# EAGLE schematic motherboard (EAGLE 8.5.0)
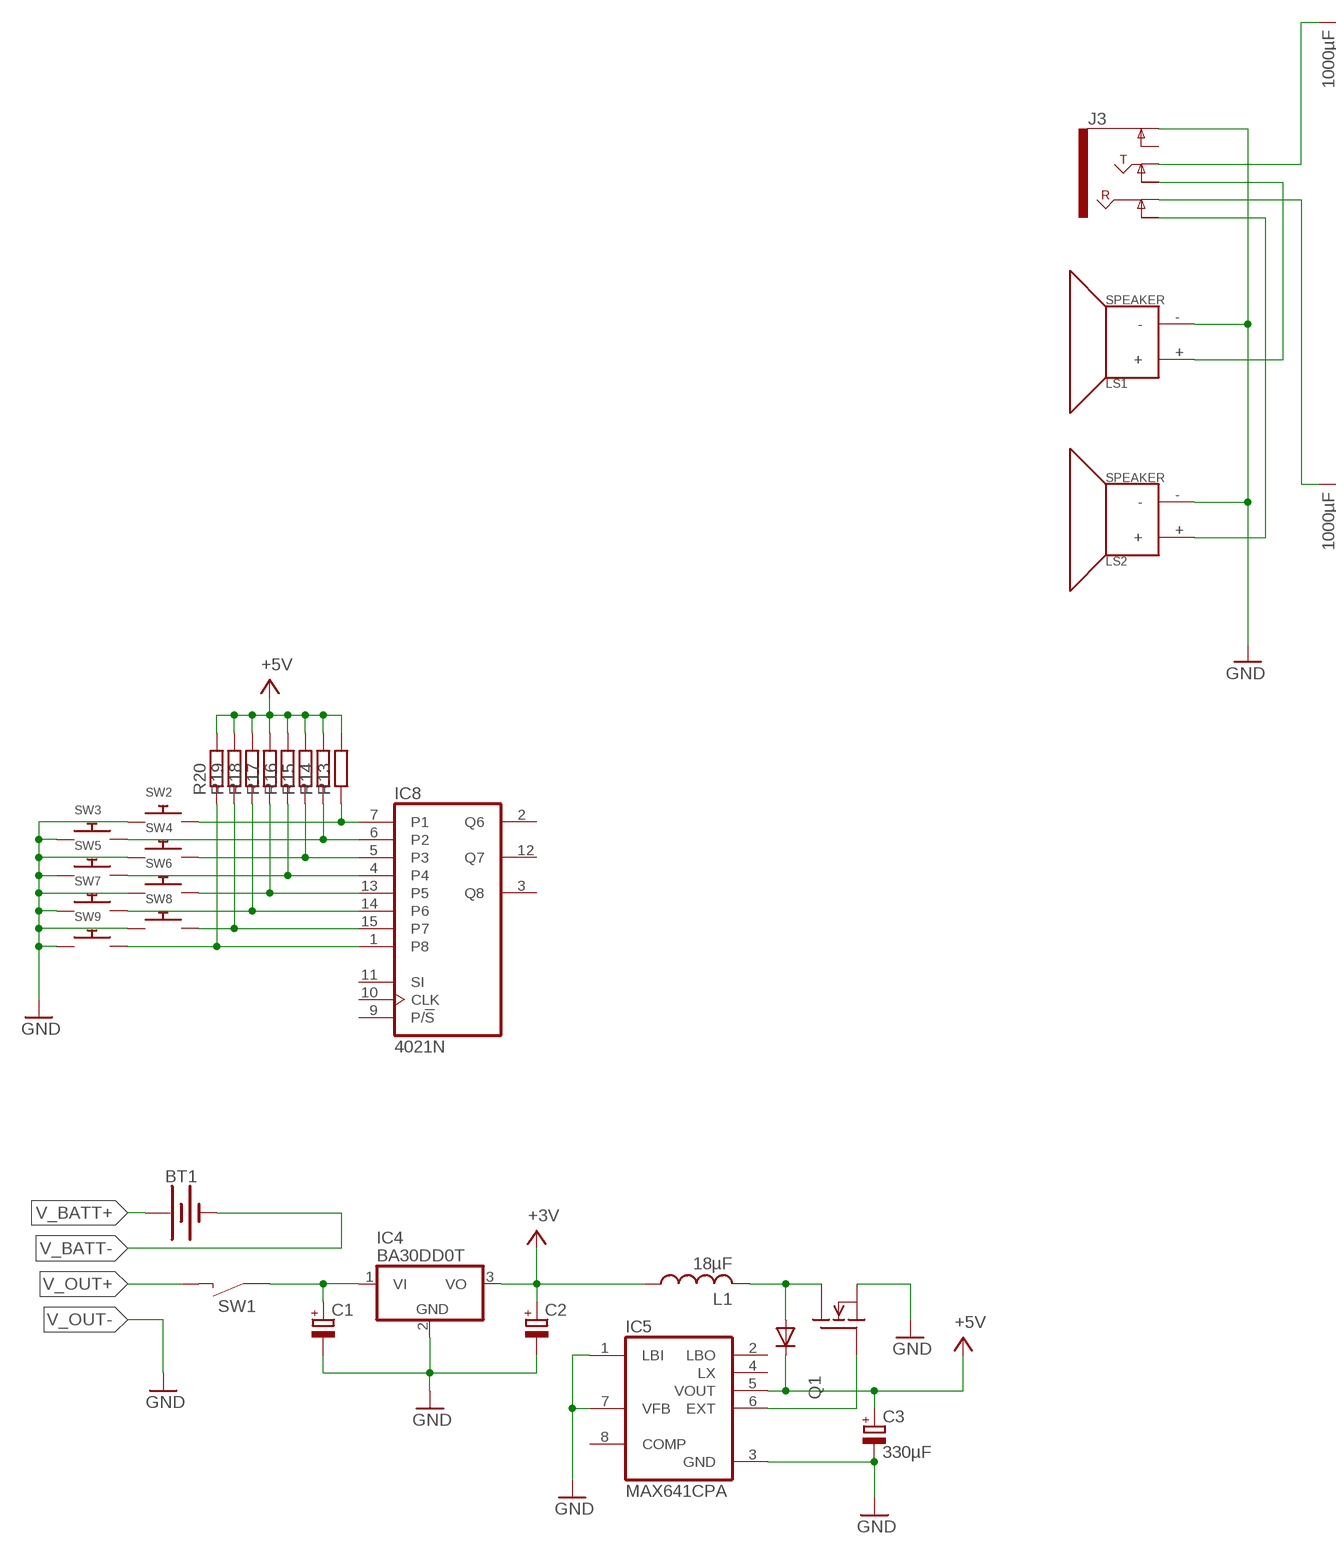
[diagram p0: schematic, sheet 1, part 1 of 2]
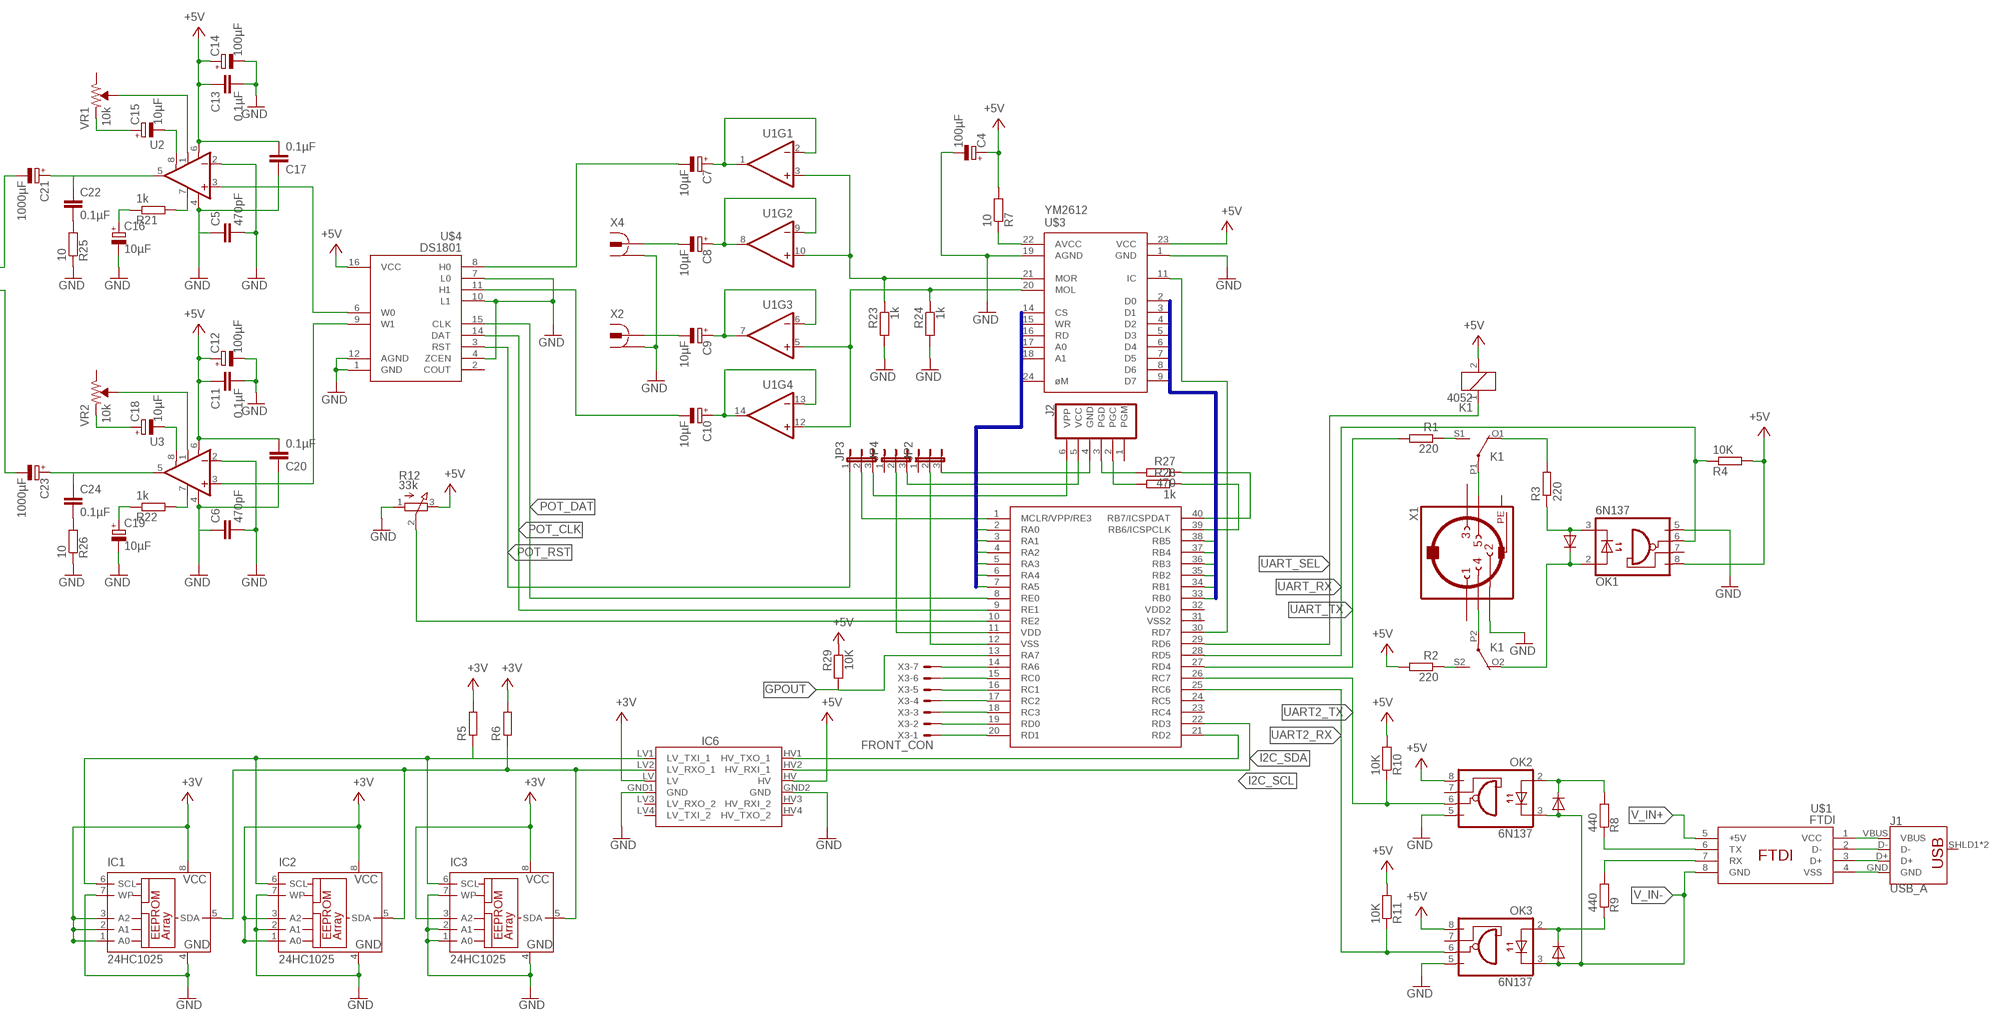
[diagram p1: schematic, sheet 1, part 2 of 2]

## Parts
BT1  BATTERY-9V  [BATTCON_9V]
C1  CPOL-EUE2,5-6E  [E2,5-6E]
C2  CPOL-EUE1.8-4  [E1,8-4]
C3  330µF  CPOL-EUE1.8-4  [E1,8-4]
C4  100µF  CPOL-EU140CLH-1010  [140CLH-1010]
C5  470pF  CAPACITOR_0805_M  [RESC0805_M]
C6  470pF  CAPACITOR_0805_M  [RESC0805_M]
C7  10µF  CPOL-EU140CLH-1010  [140CLH-1010]
C8  10µF  CPOL-EU140CLH-1010  [140CLH-1010]
C9  10µF  CPOL-EU140CLH-1010  [140CLH-1010]
C10  10µF  CPOL-EU140CLH-1010  [140CLH-1010]
C11  0.1µF  CAPACITOR_0805_M  [RESC0805_M]
C12  100µF  CPOL-EU140CLH-1010  [140CLH-1010]
C13  0.1µF  CAPACITOR_0805_M  [RESC0805_M]
C14  100µF  CPOL-EU140CLH-1010  [140CLH-1010]
C15  10µF  CPOL-EU140CLH-1010  [140CLH-1010]
C16  10µF  CPOL-EU140CLH-1010  [140CLH-1010]
C17  0.1µF  CAPACITOR_0805_M  [RESC0805_M]
C18  10µF  CPOL-EU140CLH-1010  [140CLH-1010]
C19  10µF  CPOL-EU140CLH-1010  [140CLH-1010]
C20  0.1µF  CAPACITOR_0805_M  [RESC0805_M]
C21  1000µF  CPOL-EU140CLH-1010  [140CLH-1010]
C22  0.1µF  CAPACITOR_0805_M  [RESC0805_M]
C23  1000µF  CPOL-EU140CLH-1010  [140CLH-1010]
C24  0.1µF  CAPACITOR_0805_M  [RESC0805_M]
IC1  24HC1025  24LC256P  [DIL8]
IC2  24HC1025  24LC256P  [DIL8]
IC3  24HC1025  24LC256P  [DIL8]
IC4  BA30DD0T  LM340H-18  [TO220H]
IC5  MAX641CPA  [DIL08]
IC6  SPARKFUN_LOGIC_LEVEL_CONVERTER  [SPARKFUN_LOGIC_LEVEL_CONVERTER]
IC8  4021N  [DIL16]
J1  USB_A  USB_A_PTH_MALE  [USB-A-H]
J2  PIC_ICSP_6_PIN  [MOLEX-1X6]
J3  AUDIO_JACK_TRS_0.25"_PTH_RA  [AUDIO_JACK_0.25"_TRS_PTH_RA]
JP2  JP2E  [JP2]
JP3  JP2E  [JP2]
JP4  JP2E  [JP2]
K1  4052  [F4052]
L1  18µF  L-USTJ3-U2  [TJ3-U2]
LS1  SPEAKER  [PCB_MOUNT_SPEAKER]
LS2  SPEAKER  [PCB_MOUNT_SPEAKER]
OK1  6N137  [DIL08]
OK2  6N137  [DIL08]
OK3  6N137  [DIL08]
Q1  BUZ230  [TO3]
R1  220  R-EU_0204/7  [0204/7]
R2  220  R-EU_0204/7  [0204/7]
R3  220  R-EU_0204/7  [0204/7]
R4  10K  R-EU_0204/7  [0204/7]
R5  R-EU_0204/7  [0204/7]
R6  R-EU_0204/7  [0204/7]
R7  10  R-EU_0207/10  [0207/10]
R8  440  R-EU_0204/7  [0204/7]
R9  440  R-EU_0204/7  [0204/7]
R10  10K  R-EU_0204/7  [0204/7]
R11  10K  R-EU_0204/7  [0204/7]
R12  33k  3RP/1610N  [3RP/1610N]
R13  R-EU_0204/7  [0204/7]
R14  R-EU_0204/7  [0204/7]
R15  R-EU_0204/7  [0204/7]
R16  R-EU_0204/7  [0204/7]
R17  R-EU_0204/7  [0204/7]
R18  R-EU_0204/7  [0204/7]
R19  R-EU_0204/7  [0204/7]
R20  R-EU_0204/7  [0204/7]
R21  1k  R-EU_0207/10  [0207/10]
R22  1k  R-EU_0207/10  [0207/10]
R23  1k  R-EU_0207/10  [0207/10]
R24  1k  R-EU_0207/10  [0207/10]
R25  10  R-EU_0207/10  [0207/10]
R26  10  R-EU_0207/10  [0207/10]
R27  470  R-EU_0207/10  [0207/10]
R28  1k  R-EU_0207/10  [0207/10]
R29  10K  R-EU_0207/10  [0207/10]
SW1  46202LRX  [46202LRX]
SW2  SWITCH_PUSHBUTTONEVQ-PE  [TACT_PANA-EVQ]
SW3  SWITCH_PUSHBUTTONEVQ-PE  [TACT_PANA-EVQ]
SW4  SWITCH_PUSHBUTTONEVQ-PE  [TACT_PANA-EVQ]
SW5  SWITCH_PUSHBUTTONEVQ-PE  [TACT_PANA-EVQ]
SW6  SWITCH_PUSHBUTTONEVQ-PE  [TACT_PANA-EVQ]
SW7  SWITCH_PUSHBUTTONEVQ-PE  [TACT_PANA-EVQ]
SW8  SWITCH_PUSHBUTTONEVQ-PE  [TACT_PANA-EVQ]
SW9  SWITCH_PUSHBUTTONEVQ-PE  [TACT_PANA-EVQ]
U1  LMV324  [SO14]
U2  LM386  [DIP08]
U3  LM386  [DIP08]
U$1  FTDI  [FTDI]
U$2  PIC18F47K40  [PIC18F47K40]
U$3  YM2612  [YM2612]
U$4  DS1801  [DS1081]
VR1  10k  TRIMPOT-PTH-10MM-KNOB-1/2W-10%  [TRIMPOT-PTH-3386U]
VR2  10k  TRIMPOT-PTH-10MM-KNOB-1/2W-10%  [TRIMPOT-PTH-3386U]
X1  MAB5SH  [MAB5SH]
X2  736880-49  [736880-49]
X3  FRONT_CON  22-23-2071  [22-23-2071]
X4  736880-49  [736880-49]

## Nets
GND: C1.- C2.- C3.- C4.- C5.1 C5.2 C6.1 C6.2 C11.2 C12.- C13.2 C14.- C16.- C17.1 C19.- C20.1 IC4.2(GND) IC5.1(LBI) IC5.3(GND) IC5.7(VFB) IC6.GND1(GND) IC6.GND2(GND) J3.SLEEVE(EARTH) LS1.- LS2.- OK1.5(GND) OK2.5(GND) OK3.5(GND) Q1.1(S) R12.1(A) R23.2 R24.2 R25.1 R26.1 SW2.P$1 SW3.P$1 SW4.P$1 SW5.P$1 SW6.P$1 SW7.P$1 SW8.P$1 SW9.P$1 U2.2(-IN) U2.4(V-) U3.2(-IN) U3.4(V-) U$3.1(GND) U$3.19(AGND) U$4.1(GND) U$4.4(ZCEN) U$4.7(L0) U$4.10(L1) U$4.12(AGND) X1.2 X2.1 X2.1@1 X2.1@2 X4.1 X4.1@1 X4.1@2
GPOUT: R29.2 U$2.13(RA7)
I2C_SCL: IC6.HV1(HV_TXO_1) U$2.21(RD2)
I2C_SCL_3V: IC1.6(SCL) IC2.6(SCL) IC3.6(SCL) IC6.LV1(LV_TXI_1) R5.1
I2C_SDA: IC6.HV2(HV_RXI_1) U$2.22(RD3)
I2C_SDA_3V: IC1.5(SDA) IC2.5(SDA) IC3.5(SDA) IC6.LV2(LV_RXO_1) R6.1
N$1: K1.P2(3:P) X1.4
N$2: K1.P1(2:P) X1.5
N$3: K1.S1(2:S) R1.1
N$4: K1.S2(3:S) R2.1
N$5: K1.O1(2:O) R3.2
N$6: OK1.3(C) R3.1
N$7: K1.O2(3:O) OK1.2(A)
N$8: L1.2 Q1.3(D) Q1.4(D)
N$9: C7.+ U1.1(OUT) U1.2(-IN)
N$10: IC5.6(EXT) Q1.2(G)
N$11: J1.VBUS U$1.1(VCC)
N$12: J1.D- U$1.2(D-)
N$13: J1.D+ U$1.3(D+)
N$14: J1.GND U$1.4(VSS)
N$15: OK2.2(A) R8.2
N$16: R9.2 U$1.7(RX)
N$17: R8.1 U$1.6(TX)
N$18: OK3.2(A) R9.1
N$19: J3.RING-NORM LS2.+
N$20: J3.TIP-NORM LS1.+
N$21: U$2.30(RD7) U$3.11(IC)
N$22: R27.1 U$2.40(RB7/ICSPDAT)
N$23: U$2.3(RA1)
N$24: U$2.4(RA2)
N$25: U$2.5(RA3)
N$26: U$2.6(RA4)
N$27: U$2.7(RA5)
N$28: U$2.2(RA0)
N$29: R28.1 U$2.39(RB6/ICSPCLK)
N$30: U$2.38(RB5)
N$31: U$2.37(RB4)
N$32: U$2.36(RB3)
N$33: U$2.35(RB2)
N$34: U$2.34(RB1)
N$35: U$2.33(RB0)
N$36: R12.2(S) U$2.10(RE2)
N$37: U$2.14(RA6) X3.7
N$38: U$2.15(RC0) X3.6
N$39: U$2.16(RC1) X3.5
N$40: U$2.17(RC2) X3.4
N$41: U$2.18(RC3) X3.3
N$42: U$2.19(RD0) X3.2
N$43: U$2.20(RD1) X3.1
N$44: SW1.P$2(B)
N$45: IC8.7(P1) R13.1 SW2.P$2
N$46: IC8.5(P3) R15.1 SW4.P$2
N$47: IC8.6(P2) R14.1 SW3.P$2
N$48: IC8.4 R16.1 SW5.P$2
N$49: IC8.13(P5) R17.1 SW6.P$2
N$50: IC8.14(P6) R18.1 SW7.P$2
N$51: IC8.15(P7) R19.1 SW8.P$2
N$52: IC8.1(P8) R20.1 SW9.P$2
N$53: JP4.2 U$2.11(VDD)
N$54: C15.+ VR1.1(CCW)
N$55: U2.1(GAIN) VR1.2(WIPER)
N$56: C21.+ C22.1 U2.5(OUT)
N$57: C23.+ C24.1 U3.5(OUT)
N$58: R23.1 U1.3(+IN) U1.10(+IN) U$3.21(MOR)
N$59: R24.1 U1.5(+IN) U1.12(+IN) U$3.20(MOL)
N$60: C15.- U2.8(GAIN)
N$61: R7.1 U$3.22(AVCC)
N$62: C8.+ U1.8(OUT) U1.9(-IN)
N$63: C9.+ U1.6(-IN) U1.7(OUT)
N$64: C10.+ U1.13(-IN) U1.14(OUT)
N$65: C8.- X4.2
N$66: C9.- X2.2
N$67: C7.- U$4.8(H0)
N$68: C10.- U$4.11(H1)
N$69: U2.3(+IN) U$4.6(W0)
N$70: C22.2 R25.2
N$71: R21.2 U2.7(BP)
N$72: C16.+ R21.1
N$73: U3.3(+IN) U$4.9(W1)
N$74: U3.1(GAIN) VR2.2(WIPER)
N$75: C18.+ VR2.1(CCW)
N$76: C18.- U3.8(GAIN)
N$77: R22.2 U3.7(BP)
N$78: C19.+ R22.1
N$79: C24.2 R26.2
N$80: C21.- J3.TIP
N$81: C23.- J3.RING
N$82: JP2.2 U$2.12(VSS)
N$83: J2.4(GND) JP2.3
N$84: J2.5(VCC) JP4.3
N$85: JP3.2 U$2.1(MCLR/VPP/RE3)
N$86: J2.6(VPP) JP3.3
N$87: J2.3(PGD) R27.2
N$88: J2.2(PGC) R28.2
POT_CLK: U$2.8(RE0) U$4.15(CLK)
POT_DAT: U$2.9(RE1) U$4.14(DAT)
POT_RST: JP3.1 U$4.3(RST)
UART2_RX: OK3.6(VO) R11.1 U$2.25(RC6)
UART2_TX: OK2.6(VO) R10.1 U$2.26(RC7)
UART_RX: OK1.6(VO) R4.1 U$2.28(RD5)
UART_SEL: K1.1 U$2.29(RD6)
UART_TX: R1.2 U$2.27(RD4)
V+: C2.+ C3.+ C4.+ C11.1 C12.+ C13.1 C14.+ C17.2 C20.2 IC1.1(A0) IC1.2(A1) IC1.3(A2) IC1.8(VCC) IC2.1(A0) IC2.3(A2) IC2.8(VCC) IC3.3(A2) IC3.8(VCC) IC4.3(VO) IC5.5(VOUT) IC6.HV IC6.LV K1.2 L1.1 OK1.8(VCC) OK2.8(VCC) OK3.8(VCC) R2.2 R4.2 R5.2 R6.2 R7.2 R10.2 R11.2 R12.3(E) R13.2 R14.2 R15.2 R16.2 R17.2 R18.2 R19.2 R20.2 R29.1 U2.6(V+) U3.6(V+) U$3.23(VCC) U$4.16(VCC) ; supply symbol labelled +3V, +5V
V_BATT+: BT1.+
V_BATT-: BT1.-
V_IN+: U$1.5(+5V)
V_IN-: OK2.3(C) OK3.3(C) U$1.8(GND)
V_OUT+: C1.+ IC4.1(VI) SW1.P$1(A1)
V_OUT-: IC1.4(GND) IC1.7(WP) IC2.2(A1) IC2.4(GND) IC2.7(WP) IC3.1(A0) IC3.2(A1) IC3.4(GND) IC3.7(WP) ; supply symbol labelled GND
Unconnected: IC5.2(LBO) IC5.4(LX) IC5.8(COMP) IC6.HV3(HV_RXI_2) IC6.HV4(HV_TXO_2) IC6.LV3(LV_RXO_2) IC6.LV4(LV_TXI_2) IC8.2(Q6) IC8.3(Q8) IC8.9(P/!S) IC8.10(CLK) IC8.11(SI) IC8.12(Q7) J1.SHLD1(SHIELD) J1.SHLD2(SHIELD) J2.1(PGM) J3.SLEEVE-NORM(EARTH-NORM) JP2.1 JP4.1 OK1.7(VE) OK2.7(VE) OK3.7(VE) U1.4(P$V+) U1.11(P$V-) U$2.23(RC4) U$2.24(RC5) U$2.31(VSS2) U$2.32(VDD2) U$3.2(D0) U$3.3(D1) U$3.4(D2) U$3.5(D3) U$3.6(D4) U$3.7(D5) U$3.8(D6) U$3.9(D7) U$3.14(CS) U$3.15(WR) U$3.16(RD) U$3.17(A0) U$3.18(A1) U$3.24(øM) U$4.2(COUT) VR1.3(CW) VR2.3(CW) X1.1 X1.3

## Buses
B$1
B$2

## Power pins joined to a net without a drawn wire
PE: X1.PE X1.PE@(PE)
VDD: IC8.16(VDD)
VSS: IC8.8(VSS)

## Library data of the parts
BT1 = SparkFun-Batteries:BATTERY: Battery - Single Cell A variety of battery chemistries, sizes, and footprints. Device List: 20MM_PTH - Coin Cell Battery Holder - 20mm (PTH) <https://www.sparkfun.com/products/783> 20MM_PTH_KIT- Coin Cell battery Holder - 20 mm (PTH) <http://www.sparkfun.com/products/783>kit version with special mask 6.8MM_PTH - Coin Cell Battery Holder - 6.8MM(SMD) <https://www.digikey.com/product-detail/en/seiko-instruments/MS621FE-FL11E/728-1057-ND/1889208?WT.srch=1&gclid=CNOQ5a6LzdQCFZS2wAodXCkE0g> 12MM_SMD - Coin Cell Battery Holder - 12mm (SMD) <https://www.sparkfun.com/products/10592> 12MM_PTH - Coin Cell Battery Holder - 12mm (PTH) <https://www.sparkfun.com/products/7948> 20MM_SMD - 20mm Coin Cell Battery Holder (SMD) (2 legs) Used on the Big Time Watch Kit <https://www.sparkfun.com/products/11734> 20MM_SMD_4LEGS - Coin Cell Battery Holder - 20mm (SMD) <https://www.sparkfun.com/products/11892> 20MM_SMD_4LEGS_OVERPASTE - Coin Cell Battery Holder - 20mm (SMD) <https://www.sparkfun.com/products/11892> (Over-paste on the legs) 24.5MM_PTH - Coin Cell Battery Holder - 24.5mm (PTH) <https://www.sparkfun.com/products/8863> 9V - 9V Battery Holder - PC Mount Used on the SparkFun SparkPunk Sound Kit <https://www.sparkfun.com/products/11177> and SparkFun SparkPunk Sequencer Kit <https://www.sparkfun.com/products/12707> 18650 - Battery Holder - 18650 (PTH) <https://www.sparkfun.com/products/13113> AA - Battery Holder - 1xAA (PTH) <https://www.sparkfun.com/products/7949> AAA - Battery Holder - 1xAAA (PTH) <https://www.sparkfun.com/products/12718> AA_KIT - Battery Holder - 1xAA (PTH) <https://www.sparkfun.com/products/7949> Special kit package - pads only have exposed copper on one side of the board. AAA_KIT - Battery Holder - 1xAAA (PTH) <https://www.sparkfun.com/products/12718> Special kit package - pads only have exposed copper on one side of the board.; PROD_ID: BATT-10855
C1-C3 = rcl:CPOL-EU: POLARIZED CAPACITOR, European symbol
C4 C7-C10 C12 C14-C16 C18 C19 C21 C23 = resistor:CPOL-EU: POLARIZED CAPACITOR, European symbol
C5 C6 C11 C13 C17 C20 C22 C24 = Nordic_nRF:CAPACITOR: Generic chip capacitor
IC1-IC3 = microchip:24*: Serial EEPROM I2C; MF: MICROCHIP; MPN: 24LC256-E/P; OC_FARNELL: 9757970; OC_NEWARK: 92C7169
IC4 = linear:LM340?-*: Positive VOLTAGE REGULATOR Source: http://cache.national.com/ds/LM/LM340.pdf
IC5 = maxim:MAX641CPA: Step-up SWITCHING REGULATOR CONTROLLER; OC_FARNELL: unknown; OC_NEWARK: unknown
IC6 = SparkFun-Boards:SPARKFUN_LOGIC_LEVEL_CONVERTER: SparkFun Logic Level Converter -Bi-Directional This is the mechnical outline for the 3.3V - 5V bi directional logic level converter. *Note, the "LOCK" Package has the header pins staggered by an offset of 5 mils (off center line), so that when you slide a row of standard 0.1" headers into the PTH pads, it will hold position vertically. See the follwing turorial for more information on this type of special footprints: Sneaky Footprints <https://www.sparkfun.com/tutorials/114> SparkFun Products: SparkFun Logic Level Converter - Bi-Directional <https://www.sparkfun.com/products/12009>
IC8 = 40xx:4021: 8-bit static SHIFT REGISTER
J1 = SparkFun-Connectors:USB_A: USB-A Connector Male and female variants, as well as PTH and SMT variants SparkFun Products: SparkFun XBee Explorer Dongle <https://www.sparkfun.com/products/11697> PTH Male SparkFun MicroView-USB Programmer <https://www.sparkfun.com/products/12924> SMT Male SparkFun USB Type A Female Breakout <https://www.sparkfun.com/products/12700> SMT Female; PROD_ID: CONN-08367; SF_ID: PRT-00437
J2 = SparkFun-Connectors:PIC_ICSP_6_PIN: ISCP Programming connector for PICs This 6 pin header contains all the lines necessary for programming most PIC microcontrollers. Here is the connector we sell at SparkFun: Polarized Connectors - Header (6-Pin) <https://www.sparkfun.com/products/8094> (PRT-08094) It is used on this SparkFun product: SparkFun UDB5 - PIC UAV Development Board <https://www.sparkfun.com/products/11703> (DEV-11703) Also, if you need a nice PIC programmer, please check these out: MPLAB PICkit 3 <https://www.sparkfun.com/products/9973> (PGM-09973); PROD_ID: CONN-08046; SF_ID: PRT-08094
J3 = SparkFun-Connectors:AUDIO_JACK_TRS_0.25"_PTH_RA: Audio Jack, 1/4" TRS jack, horizontal, PTH, aka "Phono jack" Find the connector here: Audio Jack - 1/4" Stereo (right angle) <https://www.sparkfun.com/products/11144> (COM-11144) Datasheet <http://cdn.sparkfun.com/datasheets/Components/General/JP-611%20DD.jpg> Note, although the datasheet and physical part are slightly different, this footprint was proven to mate well on the Proto Pedal. This device is used on these SparkFun Products: SparkFun TRS Jack Breakout - 1/4" Stereo <https://www.sparkfun.com/products/13005> (BOB-13005 ) SparkFun Proto Pedal - sorry bad link - product comming soon! <https://www.sparkfun.com/products/13124> (PRT-13124); PROD_ID: CONN-12339; SF_ID: COM-11144
JP2-JP4 = jumper:JP2E: JUMPER
K1 = relay:4052: RELAY 2 x switch, Finder; OC_FARNELL: unknown; OC_NEWARK: unknown
L1 = resistor:L-US: INDUCTOR, American symbol
LS1 LS2 = SparkFun-Electromechanical:SPEAKER: Speaker Generic 2-terminal loudspeakers SparkFun Products Speaker - PCB Mount <https://www.sparkfun.com/products/11089> (COM-11089); PROD_ID: COMP-11789; SF_SKU: COM-11089
OK1-OK3 = optocoupler:6N137: MOTOROLA OPTO COUPLER; MPN: 6N137; OC_FARNELL: 1328376; OC_NEWARK: 52M1895
Q1 = transistor-fet:BUZ230: N-Channel Enhancement MOSFET 1000V; 5,5A; 2,0Ohm
R1-R11 R13-R29 = resistor:R-EU_: RESISTOR, European symbol
R12 = pot:3RP/1610N: 16mm Potentiometer one level Source: http://www.alphapotentiometers.net/html/16mm_pot_2.html
SW1 = DC_LOAD_AU:46202LRX: 46202LRX Switch
SW2-SW9 = adafruit:SWITCH_PUSHBUTTON: Buttons SOFTTOUCHSMD_SJ - Soft touch temporary push button (Super Junk Akihabara) Compatible with SKPMANE010 [Mouser: 688-SKPMAN] C&K_KSS = Digikey: KSS221GLFS
U1 = SparkFun-IC-Amplifiers:LMV324: IC LMV324 Quad Op Amp Jellybean quad op-amp Datasheet <http://cdn.sparkfun.com/datasheets/Sensors/Sound/LMV324.pdf> SparkFun Products SparkFun Sensor Kit <https://www.sparkfun.com/products/13754> (DEV-13754) SparkFun Inventor's Kit for Arduino 101 <https://www.sparkfun.com/products/13844> (KIT-13844) SparkFun Sound Detector <https://www.sparkfun.com/products/12642> (SEN-12642); PROD_ID: IC-08227; VALUE: LMV324
U2 U3 = SparkFun-IC-Amplifiers:LM386: low voltage audio power amplifier SparkFun Products FabFM Radio Kit <https://www.sparkfun.com/products/11043> (KIT-11043); PROD_ID: IC-10899; VALUE: LM386N
U$1 = FTDI:FTDI
U$2 = pic18f47k40:PIC18F47K40
U$3 = ym2612:YM2612
U$4 = ds1801:DS1801
VR1 VR2 = SparkFun-Resistors:TRIMPOT: Trimming Potentiometer (Trimpot) Three-terminal potentiometers, with an adjustable wiper and two adjustable resistors. A pot can be used to create a configurable voltage divider, or as a variable resistor. "Trimpots" are a subset of potentiometers, usually intended for "set-and-forget" applications. They're often more delicate than standard potentiometers - rated for fewer turns. Variants PTH-KNOB - PTH Trimpot w/ finger-adjustable knob Trimpot 10K with Knob <https://www.sparkfun.com/products/9806> (COM-09806) Datasheet <http://www.sparkfun.com/datasheets/Components/General/TSR-3386.pdf> SMD-3MM-CLOSED-FRAME - SMD 3mm Square Closed-Frame Trimpot Used on e.g. EasyDriver - Stepper Motor Driver <https://www.sparkfun.com/products/12779> Datasheet <http://www.bitechnologies.com/pdfs/22.pdf> (22AR10KTR) SMD-5MM - SMD 5mm Square Closed-Frame Trimpot Used on e.g. IOIO-OTG - V2.2 <https://www.sparkfun.com/products/13613> Datasheet <http://www.vishay.com/docs/51008/ts53.pdf> (TS53YL502MR10) SMD-3MM-1/10W-25% - 3mm Square Open-Frame Trimpot Used on e.g. SparkFun Shapeoko <https://www.sparkfun.com/products/13899> Datasheet <http://www.bourns.com/docs/Product-Datasheets/TC33.pdf> (TC33X-2-103E); PROD_ID: RES-09730; SF_SKU: COM-09806
X1 = con-hirschmann:MAB5SH: Female CONNECTOR 5 pins 90 deg. with shield, horizontal (DIN 41524); OC_FARNELL: 809883; OC_NEWARK: unknown
X2 X4 = con-conrad:736880-49: Cinch Connector ( RCA Jack ) Cinch-Einbaukupplung 90º 72345 Vernickelt BKL Electronic Source: Conrad <http://www.conrad.de/ce/de/product/736880>
X3 = con-molex:22-23-2071: .100" (2.54mm) Center Header - 7 Pin; MF: MOLEX; MPN: 22-23-2071; OC_FARNELL: 1654534; OC_NEWARK: 56H0445